# EAGLE design UselessBox (EAGLE 9.6.2)
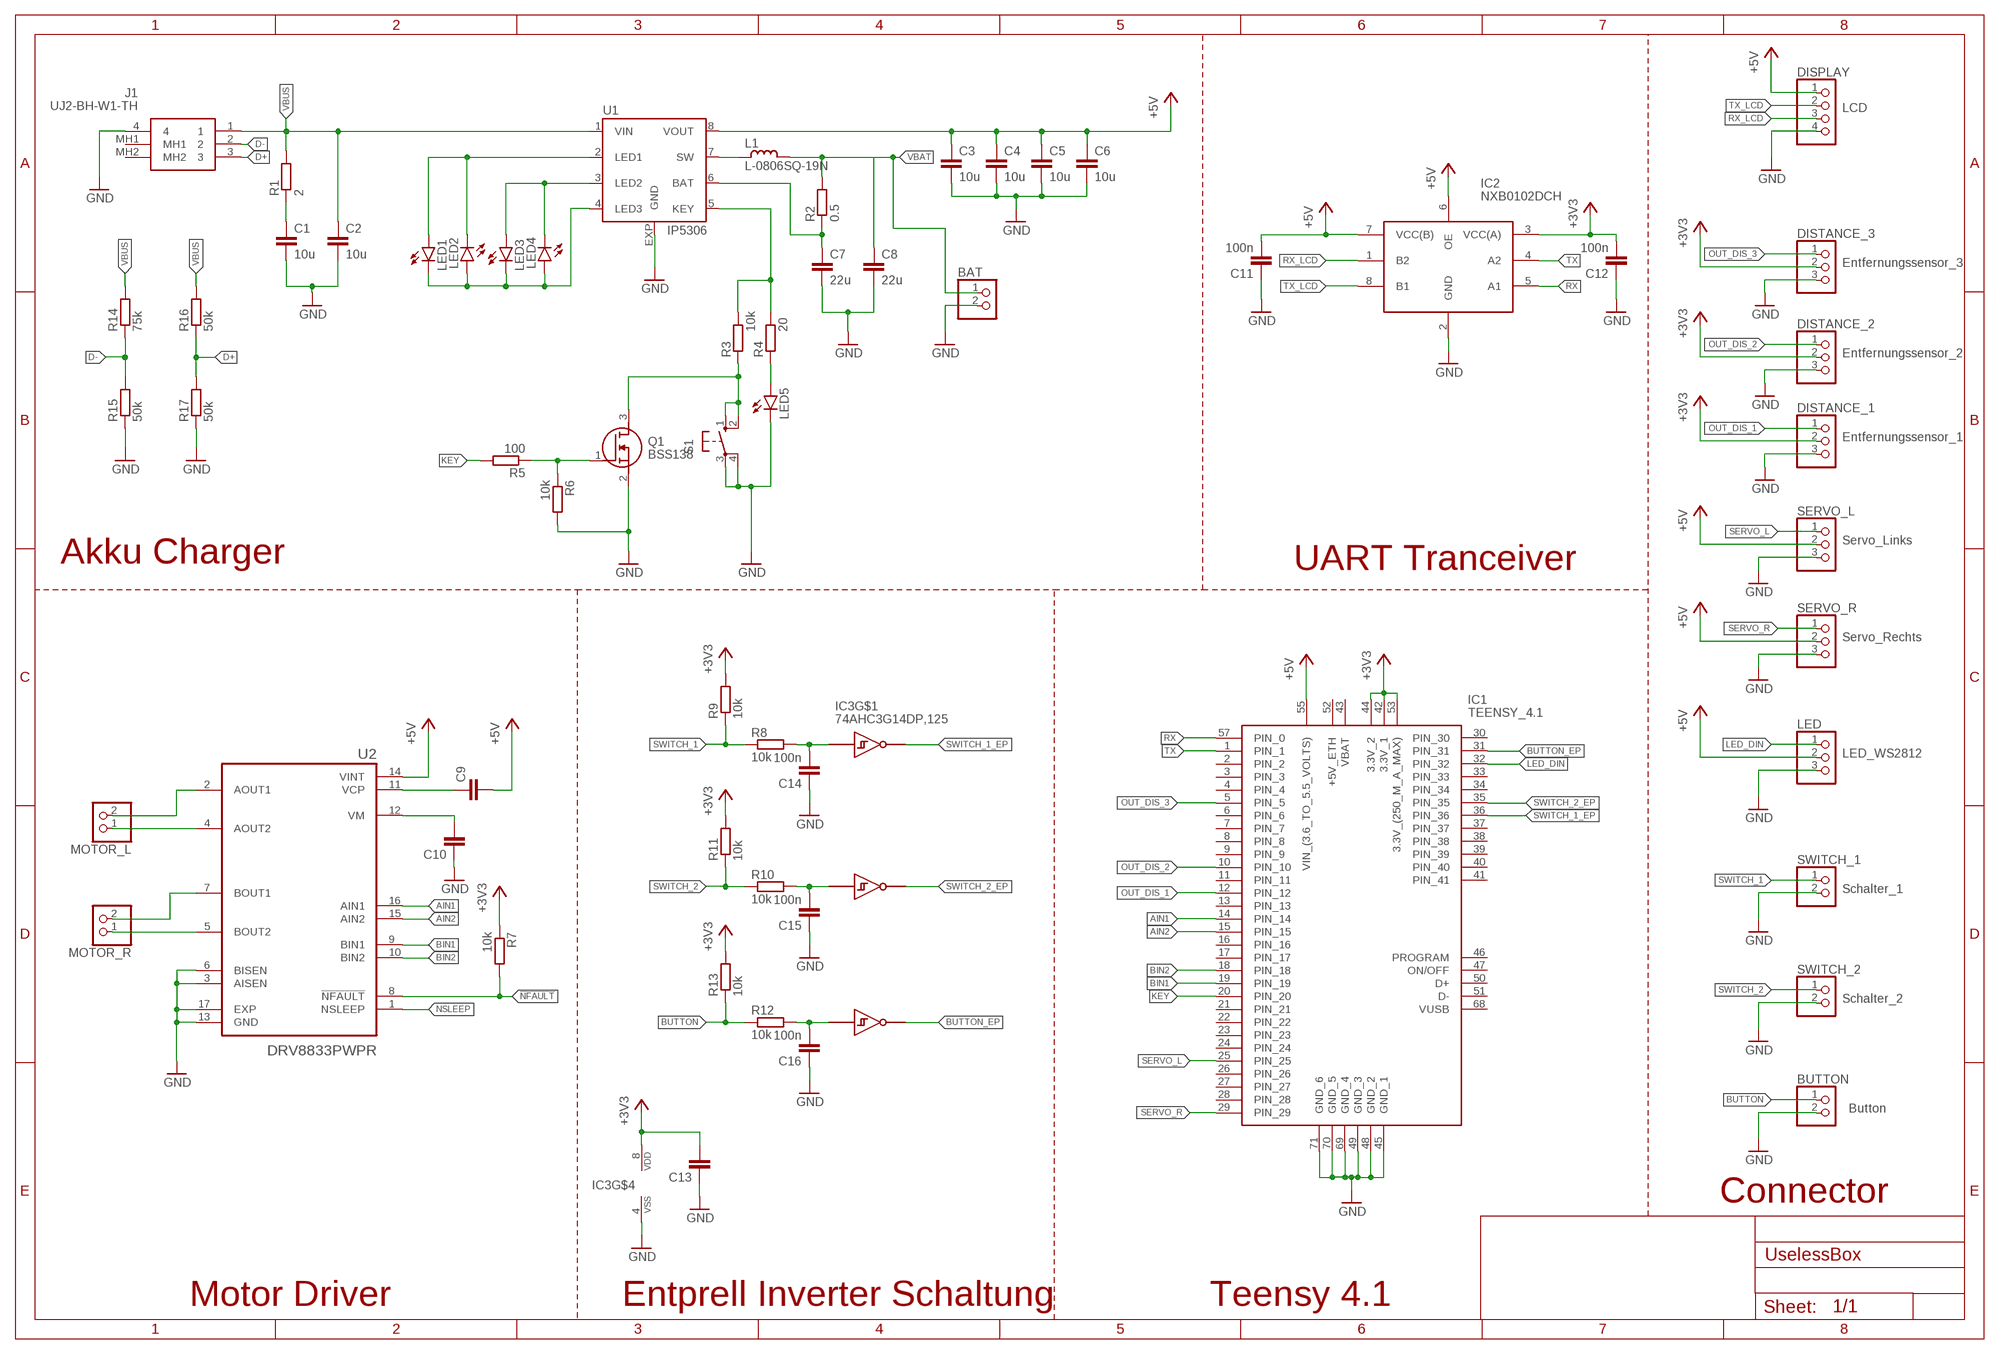
[diagram p0: schematic, sheet 1]

## Parts
BAT  PINHD-1X2  [1X02]
BUTTON  PINHD-1X2  [1X02]
C1  10u  C-EUC1206  [C1206]
C2  10u  C-EUC1206  [C1206]
C3  10u  C-EUC1206  [C1206]
C4  10u  C-EUC1206  [C1206]
C5  10u  C-EUC1206  [C1206]
C6  10u  C-EUC1206  [C1206]
C7  22u  C-EUC1206  [C1206]
C8  22u  C-EUC1206  [C1206]
C9  C-EUC0805  [C0805]
C10  C-EUC0805  [C0805]
C11  100n  C-EUC0805  [C0805]
C12  100n  C-EUC0805  [C0805]
C13  C-EUC0805  [C0805]
C14  100n  C-EUC0805  [C0805]
C15  100n  C-EUC0805  [C0805]
C16  100n  C-EUC0805  [C0805]
DISPLAY  PINHD-1X4  [1X04]
DISTANCE_1  PINHD-1X3  [1X03]
DISTANCE_2  PINHD-1X3  [1X03]
DISTANCE_3  PINHD-1X3  [1X03]
IC1  TEENSY_4.1  [TEENSY41]
IC2  NXB0102DCH  [SOP50P310X100-8N]
IC3  74AHC3G14DP,125  [SOP65P400X110-8N]
J1  UJ2-BH-W1-TH  [UJ2BHW1TH]
L1  L-0806SQ-19N  [0806SQ-19N]
LED  PINHD-1X3  [1X03]
LED1  LEDCHIPLED_0805  [CHIPLED_0805]
LED2  LEDCHIPLED_0805  [CHIPLED_0805]
LED3  LEDCHIPLED_0805  [CHIPLED_0805]
LED4  LEDCHIPLED_0805  [CHIPLED_0805]
LED5  LEDCHIPLED_0805  [CHIPLED_0805]
MOTOR_L  PINHD-1X2  [1X02]
MOTOR_R  PINHD-1X2  [1X02]
Q1  BSS138  [SOT95P240X120-3N]
R1  2  R-EU_R0805  [R0805]
R2  0.5  R-EU_R0805  [R0805]
R3  10k  R-EU_R0805  [R0805]
R4  20  R-EU_R0805  [R0805]
R5  100  R-EU_R0805  [R0805]
R6  10k  R-EU_R0805  [R0805]
R7  10k  R-EU_R0805  [R0805]
R8  10k  R-EU_R0805  [R0805]
R9  10k  R-EU_R0805  [R0805]
R10  10k  R-EU_R0805  [R0805]
R11  10k  R-EU_R0805  [R0805]
R12  10k  R-EU_R0805  [R0805]
R13  10k  R-EU_R0805  [R0805]
R14  75k  R-EU_R0805  [R0805]
R15  50k  R-EU_R0805  [R0805]
R16  50k  R-EU_R0805  [R0805]
R17  50k  R-EU_R0805  [R0805]
S1  10-XX  [B3F-10XX]
SERVO_L  PINHD-1X3  [1X03]
SERVO_R  PINHD-1X3  [1X03]
SWITCH_1  PINHD-1X2  [1X02]
SWITCH_2  PINHD-1X2  [1X02]
U1  IP5306  [SOP8-P]
U2  DRV8833PWPR  [IC_DRV8833PWPR]

## Nets
!NFAULT: R7.2 U2.8(!NFAULT)
+3V3: C12.2 C13.2 DISTANCE_1.2 DISTANCE_2.2 DISTANCE_3.2 IC1.42(3.3V_1) IC1.44(3.3V_2) IC1.53(3.3V_(250_M_A_MAX)) IC2.3(VCC(A)) IC3.8(VDD) R7.1 R9.2 R11.2 R13.2
+5V: C3.1 C4.1 C5.1 C6.1 C9.2 C11.2 DISPLAY.1 IC1.55(VIN_(3.6_TO_5.5_VOLTS)) IC2.6(OE) IC2.7(VCC(B)) LED.2 SERVO_L.2 SERVO_R.2 U1.8(VOUT) U2.14(VINT)
AIN1: IC1.14(PIN_14) U2.16(AIN1)
AIN2: IC1.15(PIN_15) U2.15(AIN2)
BIN1: IC1.19(PIN_19) U2.9(BIN1)
BIN2: IC1.18(PIN_18) U2.10(BIN2)
BUTTON: BUTTON.1 R12.1 R13.1
BUTTON_EP: IC1.31(PIN_31) IC3.2(Y)
D+: J1.3 R16.1 R17.2
D-: J1.2 R14.1 R15.2
GND: BAT.2 BUTTON.2 C1.2 C2.2 C3.2 C4.2 C5.2 C6.2 C7.2 C8.2 C10.1 C11.1 C12.1 C13.1 C14.1 C15.1 C16.1 DISPLAY.4 DISTANCE_1.3 DISTANCE_2.3 DISTANCE_3.3 IC1.45(GND_1) IC1.48(GND_2) IC1.49(GND_3) IC1.69(GND_4) IC1.70(GND_5) IC1.71(GND_6) IC2.2(GND) IC3.4(VSS) J1.4 LED5.C LED.3 Q1.2(S) R6.2 R15.1 R17.1 S1.3(P) S1.4(P1) SERVO_L.3 SERVO_R.3 SWITCH_1.2 SWITCH_2.2 U1.EXP(GND) U2.3(AISEN) U2.6(BISEN) U2.13(GND) U2.17(EXP)
KEY: IC1.20(PIN_20) R5.2
LED_DIN: IC1.32(PIN_32) LED.1
N$2: LED1.A LED2.C U1.2(LED1)
N$3: LED3.A LED4.C U1.3(LED2)
N$4: LED1.C LED2.A LED3.C LED4.A U1.4(LED3)
N$5: C1.1 R1.1
N$6: LED5.A R4.1
N$7: C7.1 R2.1 U1.6(BAT)
N$8: R3.2 R4.2 U1.5(KEY)
N$9: Q1.1(G) R5.1 R6.1
N$10: Q1.3(D) R3.1 S1.1(S) S1.2(S1)
N$11: L1.1 U1.7(SW)
N$12: MOTOR_L.1 U2.4(AOUT2)
N$13: MOTOR_L.2 U2.2(AOUT1)
N$14: MOTOR_R.1 U2.5(BOUT2)
N$15: MOTOR_R.2 U2.7(BOUT1)
N$16: C9.1 U2.11(VCP)
N$17: C10.2 U2.12(VM)
N$18: C15.2 IC3.3(A) R10.2
N$19: C14.2 IC3.1(A) R8.2
N$20: C16.2 IC3.6(A) R12.2
NSLEEP: U2.1(NSLEEP)
OUT_DIS_1: DISTANCE_1.1 IC1.12(PIN_12)
OUT_DIS_2: DISTANCE_2.1 IC1.10(PIN_10)
OUT_DIS_3: DISTANCE_3.1 IC1.5(PIN_5)
RX: IC1.57(PIN_0) IC2.5(A1)
RX_LCD: DISPLAY.3 IC2.1(B2)
SERVO_L: IC1.25(PIN_25) SERVO_L.1
SERVO_R: IC1.29(PIN_29) SERVO_R.1
SWITCH_1: R8.1 R9.1 SWITCH_1.1
SWITCH_1_EP: IC1.36(PIN_36) IC3.7(Y)
SWITCH_2: R10.1 R11.1 SWITCH_2.1
SWITCH_2_EP: IC1.35(PIN_35) IC3.5(Y)
TX: IC1.1(PIN_1) IC2.4(A2)
TX_LCD: DISPLAY.2 IC2.8(B1)
VBAT: BAT.1 C8.1 L1.2 R2.2
VBUS: C2.1 J1.1 R1.2 R14.2 R16.2 U1.1(VIN)
Unconnected: IC1.2(PIN_2) IC1.3(PIN_3) IC1.4(PIN_4) IC1.6(PIN_6) IC1.7(PIN_7) IC1.8(PIN_8) IC1.9(PIN_9) IC1.11(PIN_11) IC1.13(PIN_13) IC1.16(PIN_16) IC1.17(PIN_17) IC1.21(PIN_21) IC1.22(PIN_22) IC1.23(PIN_23) IC1.24(PIN_24) IC1.26(PIN_26) IC1.27(PIN_27) IC1.28(PIN_28) IC1.30(PIN_30) IC1.33(PIN_33) IC1.34(PIN_34) IC1.37(PIN_37) IC1.38(PIN_38) IC1.39(PIN_39) IC1.40(PIN_40) IC1.41(PIN_41) IC1.43(VBAT) IC1.46(PROGRAM) IC1.47(ON/OFF) IC1.50(D+) IC1.51(D-) IC1.52(+5V_ETH) IC1.68(VUSB) J1.MH1 J1.MH2

## Notes on the sheet
- LCD
- Entfernungssensor_3
- Entfernungssensor_2
- Entfernungssensor_1
- Servo_Links
- Akku Charger | UART Tranceiver
- Servo_Rechts
- LED_WS2812
- Schalter_1
- Schalter_2
- Button
- Connector
- Motor Driver | Entprell Inverter Schaltung | Teensy 4.1

## Library data of the parts
BAT BUTTON MOTOR_L MOTOR_R SWITCH_1 SWITCH_2 = pinhead:PINHD-1X2: PIN HEADER
C1-C16 = rcl:C-EU: CAPACITOR, European symbol; SPICEPREFIX: C
DISPLAY = pinhead:PINHD-1X4: PIN HEADER
DISTANCE_1-DISTANCE_3 LED SERVO_L SERVO_R = pinhead:PINHD-1X3: PIN HEADER
IC1 = TEENSY_4.1:TEENSY_4.1: Teensy 4.1 Development Board Source: Datasheet <https://www.pjrc.com/store/teensy41.html>; DESCRIPTION: Teensy 4.1 Development Board; HEIGHT: mm; MANUFACTURER_NAME: PJRC; MANUFACTURER_PART_NUMBER: TEENSY 4.1
IC2 = NXB0102DCH:NXB0102DCH: Voltage Level Translator 1-CH Unidirectional 8-Pin VSSOP T/R Source: Datasheet <https://assets.nexperia.com/documents/data-sheet/NXB0102.pdf>; DESCRIPTION: Voltage Level Translator 1-CH Unidirectional 8-Pin VSSOP T/R; HEIGHT: 1mm; MANUFACTURER_NAME: Nexperia; MANUFACTURER_PART_NUMBER: NXB0102DCH; MOUSER_PART_NUMBER: 771-NXB0102DCH; MOUSER_PRICE-STOCK: https://www.mouser.co.uk/ProductDetail/Nexperia/NXB0102DCH?qs=zW32dvEIR3t3BWStSBR6cA%3D%3D
IC3 = 74AHC3G14DP_125:74AHC3G14DP,125: 74AHC(T)3G14 - Triple inverting Schmitt trigger@en-us Source: Datasheet <https://assets.nexperia.com/documents/data-sheet/74AHC_AHCT3G14.pdf>; DESCRIPTION: 74AHC(T)3G14 - Triple inverting Schmitt trigger@en-us; HEIGHT: 1.1mm; MANUFACTURER_NAME: Nexperia; MANUFACTURER_PART_NUMBER: 74AHC3G14DP,125; MOUSER_PART_NUMBER: 771-AHC3G14DP125; MOUSER_PRICE-STOCK: https://www.mouser.co.uk/ProductDetail/Nexperia/74AHC3G14DP125?qs=P62ublwmbi8pkJ4kOimCvQ%3D%3D
J1 = UJ2-BH-W1-TH:UJ2-BH-W1-TH: USB Connectors USB 2.0 type B jack 4 pin Horiz White TH Source: Datasheet <https://www.cuidevices.com/product/resource/uj2-bh-th.pdf>; ARROW_PART_NUMBER: UJ2-BH-W1-TH; ARROW_PRICE-STOCK: https://www.arrow.com/en/products/uj2-bh-w1-th/cui-devices?region=nac; DESCRIPTION: USB Connectors USB 2.0 type B jack 4 pin Horiz White TH; HEIGHT: 11.48mm; MANUFACTURER_NAME: CUI Inc.; MANUFACTURER_PART_NUMBER: UJ2-BH-W1-TH; MOUSER_PART_NUMBER: 490-UJ2-BH-W1-TH; MOUSER_PRICE-STOCK: https://www.mouser.co.uk/ProductDetail/CUI-Devices/UJ2-BH-W1-TH?qs=5mqXD9RfOg3dpHLjDScu%2Fg%3D%3D
L1 = inductor-coilcraft2:L-: SMD INDUCTOR
LED1-LED5 = led:LED: LED OSRAM: - CHIPLED LG R971, LG N971, LY N971, LG Q971, LY Q971, LO R971, LY R971 LH N974, LH R974 LS Q976, LO Q976, LY Q976 LO Q996 - Hyper CHIPLED LW Q18S LB Q993, LB Q99A, LB R99A - SideLED LS A670, LO A670, LY A670, LG A670, LP A670 LB A673, LV A673, LT A673, LW A673 LH A674 LY A675 LS A676, LA A676, LO A676, LY A676, LW A676 LS A679, LY A679, LG A679 - Hyper Micro SIDELED® LS Y876, LA Y876, LO Y876, LY Y876 LT Y87S - SmartLED LW L88C, LW L88S LB L89C, LB L89S, LG L890 LS L89K, LO L89K, LY L89K LS L896, LA L896, LO L896, LY L896 - TOPLED LS T670, LO T670, LY T670, LG T670, LP T670 LSG T670, LSP T670, LSY T670, LOP T670, LYG T670 LG T671, LOG T671, LSG T671 LB T673, LV T673, LT T673, LW T673 LH T674 LS T676, LA T676, LO T676, LY T676, LB T676, LH T676, LSB T676, LW T676 LB T67C, LV T67C, LT T67C, LS T67K, LO T67K, LY T67K, LW E67C LS E67B, LA E67B, LO E67B, LY E67B, LB E67C, LV E67C, LT E67C LW T67C LS T679, LY T679, LG T679 LS T770, LO T770, LY T770, LG T770, LP T770 LB T773, LV T773, LT T773, LW T773 LH T774 LS E675, LA E675, LY E675, LS T675 LS T776, LA T776, LO T776, LY T776, LB T776 LHGB T686 LT T68C, LB T68C - Hyper Mini TOPLED® LB M676 - Mini TOPLED Santana® LG M470 LS M47K, LO M47K, LY M47K Source: http://www.osram.convergy.de LUXEON: - LUMILED® LXK2-PW12-R00, LXK2-PW12-S00, LXK2-PW14-U00, LXK2-PW14-V00 LXK2-PM12-R00, LXK2-PM12-S00, LXK2-PM14-U00 LXK2-PE12-Q00, LXK2-PE12-R00, LXK2-PE12-S00, LXK2-PE14-T00, LXK2-PE14-U00 LXK2-PB12-K00, LXK2-PB12-L00, LXK2-PB12-M00, LXK2-PB14-N00, LXK2-PB14-P00, LXK2-PB14-Q00 LXK2-PR12-L00, LXK2-PR12-M00, LXK2-PR14-Q00, LXK2-PR14-R00 LXK2-PD12-Q00, LXK2-PD12-R00, LXK2-PD12-S00 LXK2-PH12-R00, LXK2-PH12-S00 LXK2-PL12-P00, LXK2-PL12-Q00, LXK2-PL12-R00 Source: www.luxeon.com KINGBRIGHT: KA-3528ASYC Source: www.kingbright.com
Q1 = BSS138:BSS138: N-channel MOSFET,BSS138 0.2A 50V Source: Datasheet <https://www.onsemi.com/pub/Collateral/BSS138-D.PDF>; ARROW_PART_NUMBER: BSS138; ARROW_PRICE-STOCK: https://www.arrow.com/en/products/bss138/on-semiconductor; DESCRIPTION: N-channel MOSFET,BSS138 0.2A 50V; HEIGHT: 1.2mm; MANUFACTURER_NAME: onsemi; MANUFACTURER_PART_NUMBER: BSS138; MOUSER_PART_NUMBER: 512-BSS138; MOUSER_PRICE-STOCK: https://www.mouser.co.uk/ProductDetail/ON-Semiconductor-Fairchild/BSS138?qs=HK%252BeIG1iaahCeqBvjB4arg%3D%3D
R1-R17 = rcl:R-EU_: RESISTOR, European symbol; SPICEPREFIX: R
S1 = switch-omron:10-XX: OMRON SWITCH; MPN: B3F-1000; OC_FARNELL: 176432; OC_NEWARK: 36M3542
U1 = IP5306:IP5306: Check availability <https://pricing.snapeda.com/parts/IP5306/NXP%20USA%20Inc./view-part?ref=eda>; AVAILABILITY: In Stock; DESCRIPTION: RC (Pi) EMI Filter 2nd Order Low Pass 2 Channel R = 2.2kOhms, C = 1700pF 8-UFBGA, WLCSP; MF: NXP USA Inc.; MP: IP5306; PACKAGE: UFBGA-8 NXP Semiconductors; PRICE: None; PURCHASE-URL: https://pricing.snapeda.com/search/part/IP5306/?ref=eda
U2 = DRV8833PWPR:DRV8833PWPR: 10.8-V, 2-A dual H-bridge motor driver with current regulation 16-HTSSOP -40 to 85 Check availability <https://pricing.snapeda.com/parts/DRV8833PWPR/Texas%20Instruments/view-part?ref=eda>; AVAILABILITY: In Stock; DESCRIPTION: 10.8-V, 2-A dual H-bridge motor driver with current regulation; MF: Texas Instruments; MP: DRV8833PWPR; PACKAGE: HTSSOP-16 Texas Instruments; PRICE: None; PURCHASE-URL: https://pricing.snapeda.com/search/part/DRV8833PWPR/?ref=eda

## Board
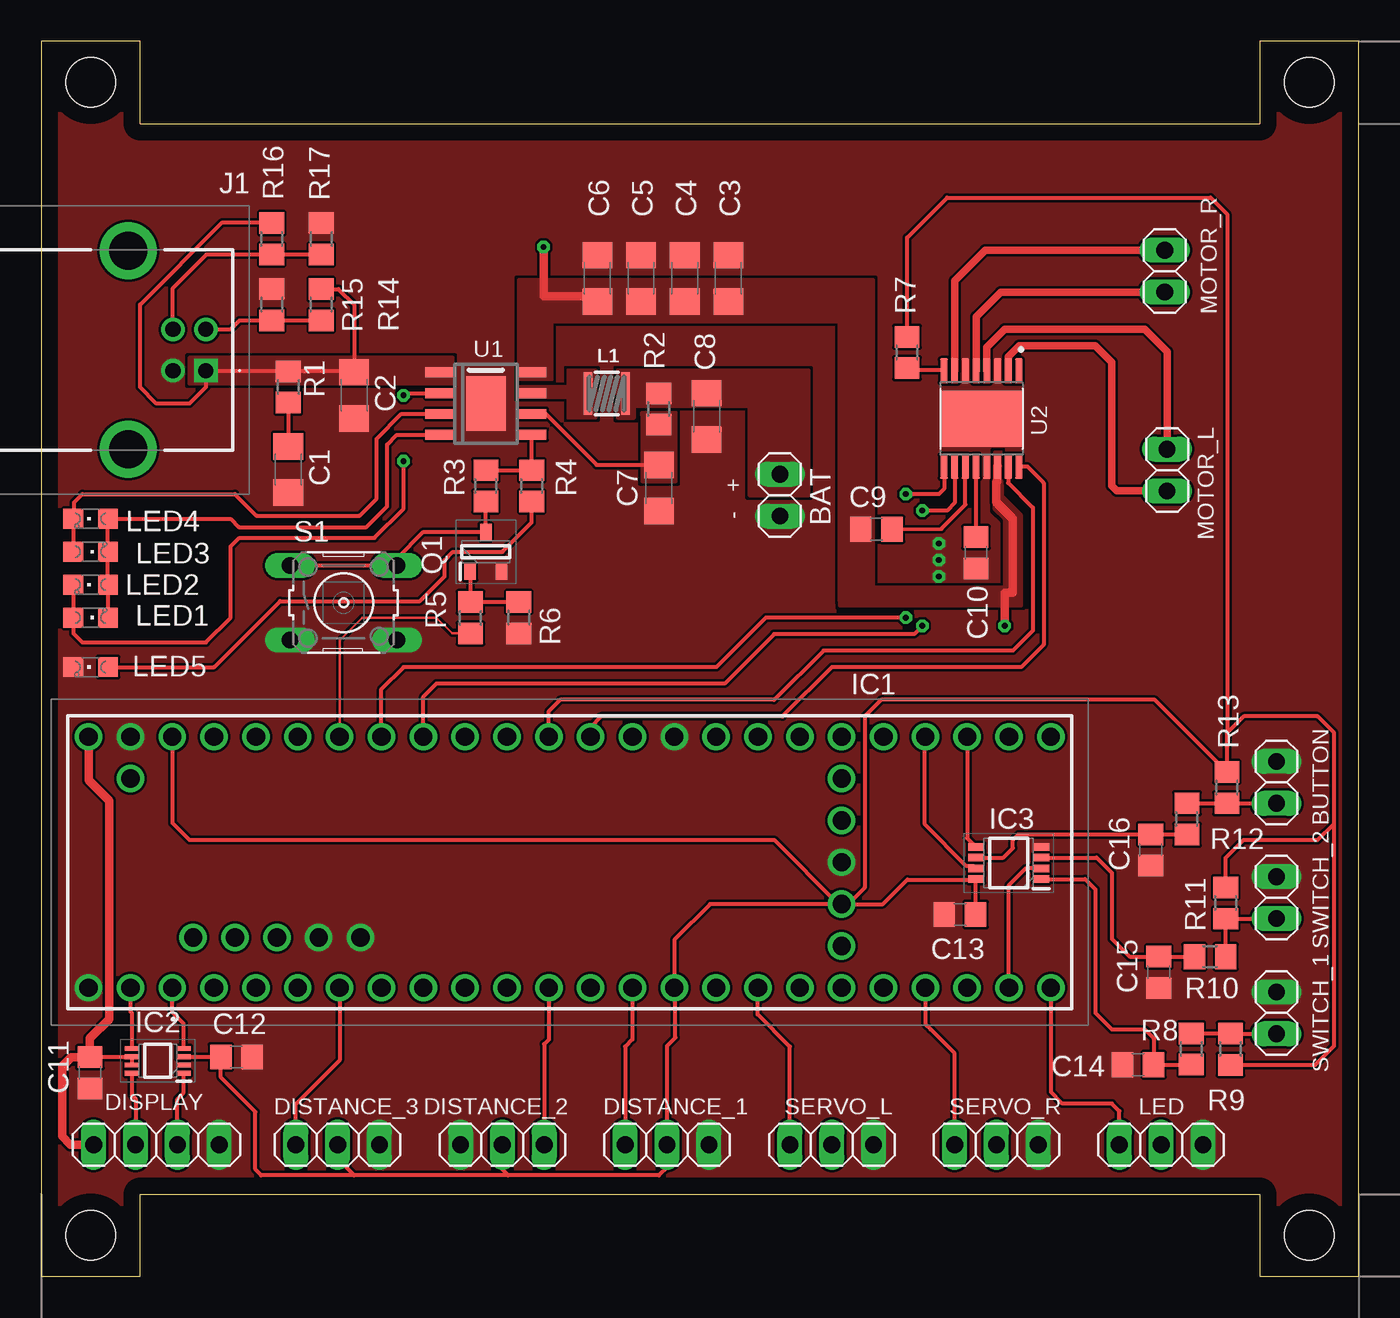
[diagram p1: board, top side]
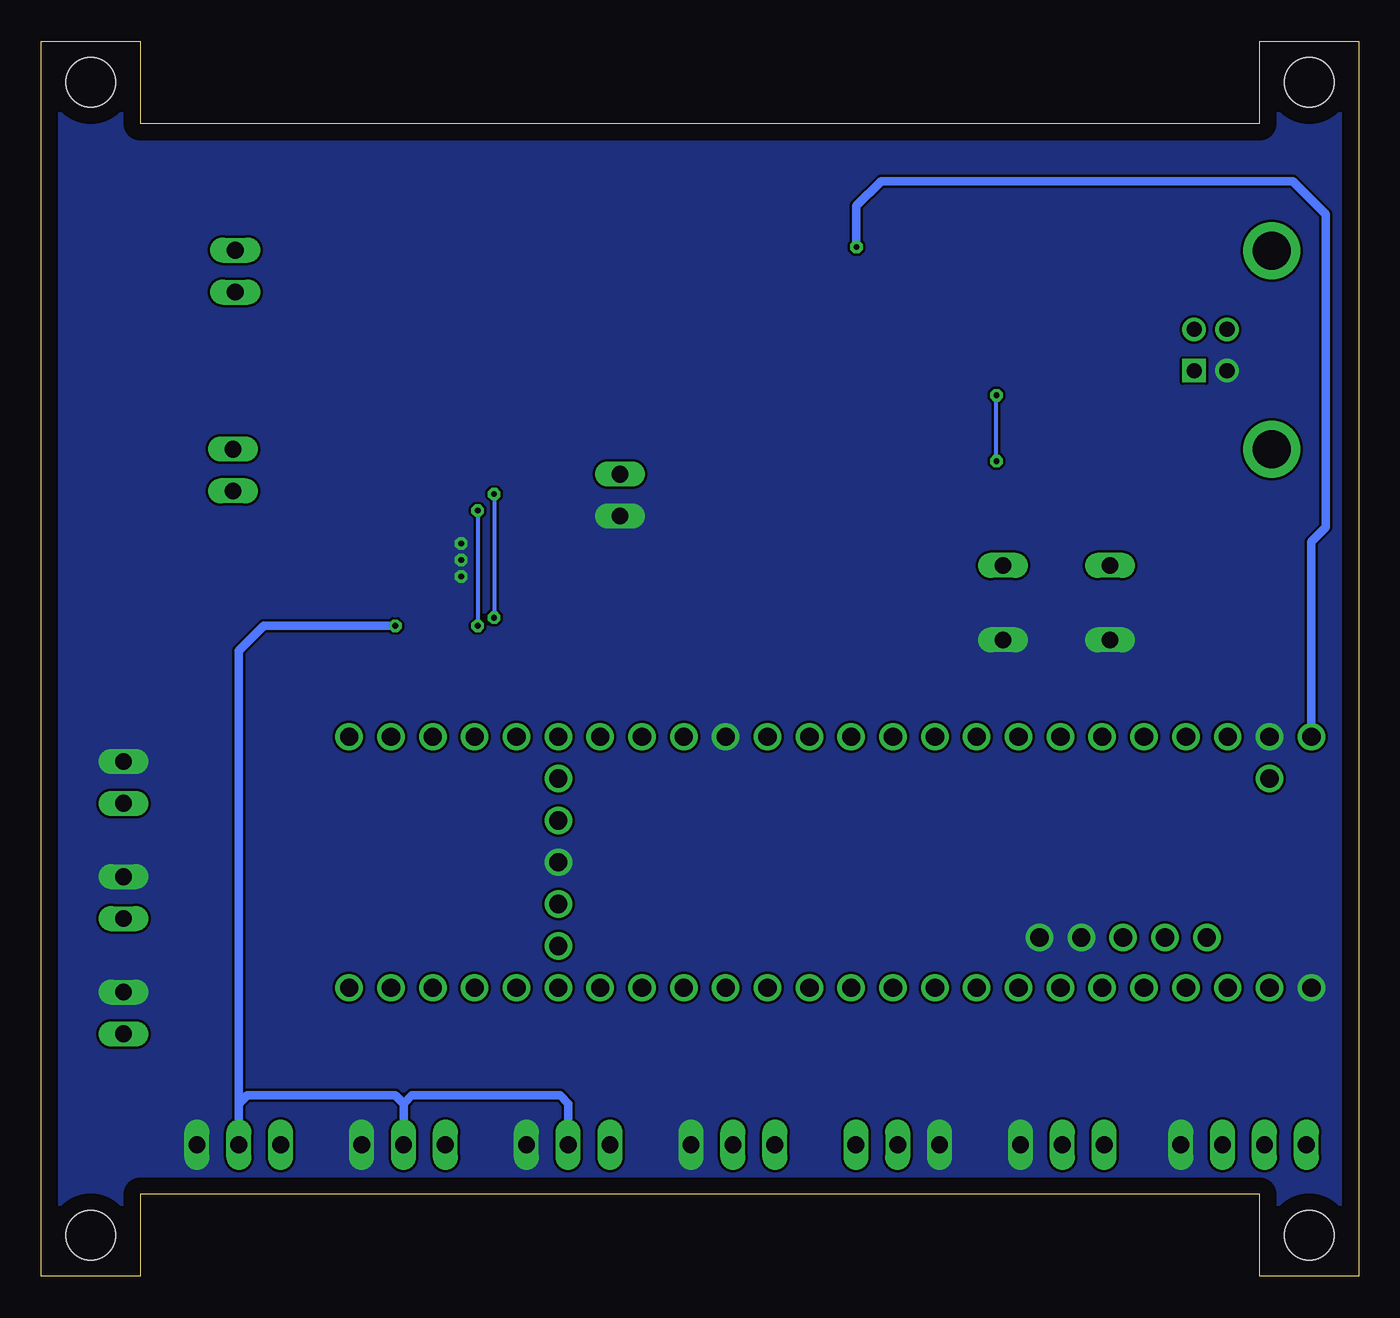
[diagram p2: board, bottom side, seen from below]

Size 80 x 75 mm. Coordinates in mm from the lower left corner, seen from the top.
Outline: 80,0 80,75 74,75 74,70 6,70 6,75 0,75 0,0 6,0 6,5 74,5 74,0 80,0
Copper layers (1*16): Top 0.035mm / dielectric 1.5mm / Bottom 0.035mm
Design rules "default": minimum track width 6mil, minimum drill 0.35mm, track to track 6mil, track to pad 6mil, pad to pad 6mil, via to via 6mil, smd to smd 6mil, copper to edge 40mil, drill to drill 6mil, minimum pad ring 10mil, minimum via ring 8mil, stop-mask expansion 4mil, vias tented up to drill 0mil, thermal gap 10mil
Holes 3 mm at 3,2.5 77,2.5 3,72.5 77,72.5

### Footprints (pad centres in the part's own frame; a part is rotated, then mirrored left to right if it is on the bottom)
1X02 = drill 1.016 long: 1 -1.27,0; 2 1.27,0
C1206 = smd 1.6 x 1.8: 1 -1.4,0; 2 1.4,0
C0805 = smd 1.3 x 1.5: 1 -0.95,0; 2 0.95,0
1X04 = drill 1.016 long: 1 -3.81,0; 2 -1.27,0; 3 1.27,0; 4 3.81,0
1X03 = drill 1.016 long: 1 -2.54,0; 2 0,0; 3 2.54,0
TEENSY41 = drill 1.11 pad 1.665: 1 0,0; 2 2.54,0; 3 5.08,0; 4 7.62,0; 5 10.16,0; 6 12.7,0; 7 15.24,0; 8 17.78,0; 9 20.32,0; 10 22.86,0; 11 25.4,0; 12 27.94,0; 13 27.94,15.24; 14 25.4,15.24; 15 22.86,15.24; 16 20.32,15.24; 17 17.78,15.24; 18 15.24,15.24; 19 12.7,15.24; 20 10.16,15.24; 21 7.62,15.24; 22 5.08,15.24; 23 2.54,15.24; 24 33.02,0; 25 35.56,0; 26 38.1,0; 27 40.64,0; 28 43.18,0; 29 45.72,0; 30 48.26,0; 31 50.8,0; 32 53.34,0; 33 53.34,15.24; 34 50.8,15.24; 35 48.26,15.24; 36 45.72,15.24; 37 43.18,15.24; 38 40.64,15.24; 39 38.1,15.24; 40 35.56,15.24; 41 33.02,15.24; 42 30.48,0; 43 40.64,2.54; 44 40.64,5.08; 45 40.64,7.62; 46 40.64,10.16; 47 40.64,12.7; 48 11.43,3.05; 49 8.89,3.05; 50 6.35,3.05; 51 3.81,3.05; 52 1.27,3.05; 53 0,15.24; 55 -5.08,15.24; 57 -2.54,0; 68 -2.54,12.7; 69 30.48,15.24; 70 -2.54,15.24; 71 -5.08,0
SOP50P310X100-8N = smd 0.85 x 0.3: 1 -1.575,0.75; 2 -1.575,0.25; 3 -1.575,-0.25; 4 -1.575,-0.75; 5 1.575,-0.75; 6 1.575,-0.25; 7 1.575,0.25; 8 1.575,0.75
SOP65P400X110-8N = smd 0.95 x 0.45: 1 -1.975,0.975; 2 -1.975,0.325; 3 -1.975,-0.325; 4 -1.975,-0.975; 5 1.975,-0.975; 6 1.975,-0.325; 7 1.975,0.325; 8 1.975,0.975
UJ2BHW1TH = drill 0.92 pad 1.431 square: 1 0,0 | drill 0.92 pad 1.431: 2 -2.5,0; 3 -2.5,-2; 4 0,-2 | drill 2.3 pad 3.45: MH1 -7.27,-4.71; MH2 4.77,-4.71
0806SQ-19N = smd 0.51 x 2.6: 1 -1.145,0; 2 1.145,0
CHIPLED_0805 = smd 1.2 x 1.2: A 0,-1.05; C 0,1.05
SOT95P240X120-3N = smd 1 x 0.7: 1 -1.2,0.95; 2 -1.2,-0.95; 3 1.2,0
R0805 = smd 1.3 x 1.5: 1 -0.95,0; 2 0.95,0
B3F-10XX = drill 1.016 long: 1 -3.251,2.261; 2 3.251,2.261; 3 -3.251,-2.261; 4 3.251,-2.261
SOP8-P = smd 0.6 x 1.75: 1 -1.905,-2.8; 2 -0.635,-2.8; 3 0.635,-2.8; 4 1.905,-2.8; 5 1.905,2.8; 6 0.635,2.8; 7 -0.635,2.8; 8 -1.905,2.8 | smd 3.3 x 2.41: EXP 0,0
IC_DRV8833PWPR = smd 1.5 x 0.45: 1 -2.9,2.275; 2 -2.9,1.625; 3 -2.9,0.975; 4 -2.9,0.325; 5 -2.9,-0.325; 6 -2.9,-0.975; 7 -2.9,-1.625; 8 -2.9,-2.275; 9 2.9,-2.275; 10 2.9,-1.625; 11 2.9,-0.975; 12 2.9,-0.325; 13 2.9,0.325; 14 2.9,0.975; 15 2.9,1.625; 16 2.9,2.275 | smd 3.4 x 5: 17 0,0

### Placement (x,y rotation side)
BAT  44.85,47.44 270 top
BUTTON  75,30 90 top
C1  15,49 270 top
C2  19,53.5 270 top
C3  41.72,60.6 90 top
C4  39.07,60.6 90 top
C5  36.42,60.6 90 top
C6  33.77,60.6 90 top
C7  37.5,47.87 270 top
C8  40.4,52.22 270 top
C9  50.71,45.37 180 top
C10  56.76,43.94 90 top
C11  2.96,12.37 90 top
C12  11.86,13.33 180 top
C13  55.78,21.98 0 top
C14  66.59,12.86 0 top
C15  67.85,18.47 90 top
C16  67.37,25.89 90 top
DISPLAY  7,8 0 top
DISTANCE_1  38,8 0 top
DISTANCE_2  28,8 180 top
DISTANCE_3  18,8 0 top
IC1  7.96,17.53 0 top
IC2  7.08,13.09 180 top
IC3  58.74,25.1 180 top
J1  10,55 270 top
L1  34.34,53.61 0 top
LED  68,8 0 top
LED1  3,40 270 top
LED2  3,42 90 top
LED3  3,44 270 top
LED4  3,46 90 top
LED5  3,37 90 top
MOTOR_L  68.36,48.96 270 top
MOTOR_R  68.22,61.04 90 top
Q1  27,44 90 top
R1  15,54 90 top
R2  37.5,52.67 90 top
R3  27,48 90 top
R4  29.78,48 90 top
R5  26.06,39.99 270 top
R6  29,40 270 top
R7  52.57,56.1 270 top
R8  69.82,13.81 270 top
R9  72.21,13.8 270 top
R10  70.97,19.41 180 top
R11  71.92,22.67 90 top
R12  69.56,27.78 270 top
R13  71.99,29.68 90 top
R14  17,59 90 top
R15  14,59 270 top
R16  14,63 90 top
R17  17,63 270 top
S1  18.36,40.91 0 top
SERVO_L  48,8 0 top
SERVO_R  58,8 0 top
SWITCH_1  75,16 90 top
SWITCH_2  75,23 90 top
U1  27,53 270 top
U2  57.09,52.08 270 top

### Tracks (layer width: path | path; a pad name or v marks a point on that pad's centre or on a via)
!NFAULT
  Top 0.254: U2.8 54.76,55.03 52.81,55.03 52.69,55.15 R7.2
+3V3
  Top 0.254: IC2.3 C12.2 10.91,12.09 13,10 13,6.5 13.36,6.14 19,6.14 | C13.2 56.73,24.09 | 56.73,24.09 IC3.8 | IC1.44 49,22.61 | 49,22.61 51.11,22.61 52.59,24.09 56.73,24.09 | 28.36,6.14 28,6.5 DISTANCE_2.2 | 28.36,6.14 37.5,6.14 38,6.64 DISTANCE_1.2 38,14 38.5,14.5 38.5,17.47 IC1.42 38.44,20.44 40.61,22.61 IC1.44 | 28.36,6.14 19,6.14 | 19,6.14 18,7.14 DISTANCE_3.2 | R11.2 71.92,25.42 73,26.5 77.5,26.5 78.5,27.5 | 71.99,32.5 71.99,32.99 73,34 77.5,34 78.5,33 78.5,27.5 | 71.99,32.5 R13.2 67.62,35 51,35 50,34 50,23.61 49,22.61 | R9.2 77.35,12.85 78.5,14 78.5,27.5 | R7.1 52.57,63.07 55,65.5 71,65.5 72,64.5 72,32.51 71.99,32.5 | IC1.53 7.96,27.54 9,26.5 44.5,26.5 48.39,22.61 IC1.44
+5V  (via drill 0.35)
  Top 0.254: C11.2 2.98,13.34 IC2.6 IC2.7
  Top 0.508: DISPLAY.1 1.77,8 1.27,8.5 1.27,12.77 1.82,13.32 C11.2 2.96,14.46 4.12,15.62 4.12,28.88 2.88,30.12 IC1.55 | v30.5,62.5 30.5,59.5 33.47,59.5 C6.1 | v58.5,39.5 58.5,41.5 59,41.5 59,46 58,47 58,48.25 58.05,48.3 58.05,49.16 U2.14
  Bottom 0.508: SERVO_L.2 48,10.5 48.5,11 57.5,11 58,10.5 | SERVO_R.2 58,10.5 | 58,10.5 58.5,11 67.5,11 68,10.5 | 68,10.5 LED.2 | IC1.55 2.88,44.62 2,45.5 2,64.5 4,66.5 29,66.5 30.5,65 v30.5,62.5 | 68,10.5 68,38 66.5,39.5 v58.5,39.5
  pour Top (no thermals): 29,60.5 29,54.5 31,54.5 31,58 50.5,58 50.5,60.5
  pour Top (no thermals): 50.5,60.5 50.5,41 48.5,41 48.5,60.5
  pour Top (no thermals): 48.5,40.75 59.5,40.75 59.5,46.21 58.34,47.37 58.34,50 57.88,50 57.88,46.62 58.5,46 58.5,41.82 48.5,41.82
AIN1
  Top 0.254: U2.16 59.87,49.18 60.87,48.18 60.87,38.37 59.5,37 48,37 45,34 34,34 33.36,33.36 IC1.14
AIN2
  Top 0.254: U2.15 58.72,48.18 60.22,46.68 60.22,39.22 59,38 47.5,38 44.5,35 31.5,35 30.82,34.32 IC1.15
BIN1  (via drill 0.35)
  Top 0.254: v52.5,40 44,40 41,37 22,37 20.66,35.66 IC1.19 | U2.9 54.81,47.81 54.5,47.5 v52.5,47.5
  Bottom 0.254: v52.5,47.5 v52.5,40
BIN2  (via drill 0.35)
  Top 0.254: v53.5,39.5 53,39 44.5,39 41.5,36 24,36 23.2,35.2 IC1.18 | U2.10 55.47,46.97 55,46.5 v53.5,46.5
  Bottom 0.254: v53.5,46.5 v53.5,39.5
BUTTON
  Top 0.254: R12.1 R13.1 BUTTON.1
BUTTON_EP
  Top 0.254: IC3.2 59.77,24.77 58.86,23.86 58.76,23.76 IC1.31
D+
  Top 0.254: J1.3 8,60 10.05,62.05 R16.1 R17.2
D-
  Top 0.254: J1.2 11.5,57.5 12.05,58.05 R15.2 R14.1
GND  (via drill 0.35)
  other vias: 54.5,44.5 54.5,43.5 54.5,42.5
  pour Top (rank 2, no thermals): 54.5,56 54.5,48 60,48 60,56
  pour Top (rank 2, no thermals): -3.5,73.5 87,73.5 87,15 87,-1.5 -5,-1.5 -5,73.5
  pour Bottom (rank 2, no thermals): -5,73.5 87,73.5 87,-1.5 -5,-1.5
KEY
  Top 0.152: R5.2 24.96,39.04 24,40 19.5,40 18.12,38.62 IC1.20
LED_DIN
  Top 0.254: LED.1 65.46,10.04 65,10.5 62,10.5 61.3,11.2 IC1.32
N$2  (via drill 0.35)
  Top 0.254: LED2.C LED1.A 1.95,39.05 2.5,38.5 10,38.5 11.5,40 11.5,44.32 12.03,44.85 20.23,44.85 22,46.62 v22,49.5 | v22,53.5 22.14,53.63 U1.2
  Bottom 0.254: v22,49.5 v22,53.5
N$3
  Top 0.254: LED3.A LED4.C 2,46.05 2,47 2.5,47.5 11.76,47.5 13.07,46.19 19.33,46.19 20.36,47.22 20.36,50.86 21.86,52.37 U1.3
N$4
  Top 0.254: LED1.C LED2.A LED3.C LED4.A 11.5,46 12,45.5 19.74,45.5 21,46.76 21,50.5 21.59,51.09 U1.4
N$5
  Top 0.254: R1.1 C1.1
N$6
  Top 0.254: LED5.A 10.5,37 14.5,41 23,41 24.5,42.5 24.5,43.5 25,44 28,44 29.78,45.78 R4.1
N$7
  Top 0.254: U1.6 30.64,52.37 33.73,49.27 C7.1
  pour Top (no thermals): 36.49,52.38 36.49,48.29 38.53,48.29 38.54,48.29 38.54,52.41 36.48,52.41 36.48,52.3
N$8
  Top 0.254: R3.2 R4.2 29.78,51.09 U1.5
N$9
  Top 0.254: Q1.1 R5.1 R6.1
N$10
  Top 0.254: R3.1 Q1.3 23.2,45.2 21.61,43.61 S1.2 S1.1
N$11
  pour Top (no thermals): 28.99,53.4 32,53.4 32,52.16 33.67,52.16 33.67,55 32,55 32,54 29,54 29,53.41
N$12
  Top 0.457: U2.4 57.41,56.41 58.5,57.5 67,57.5 68.36,56.14 MOTOR_L.1
N$13
  Top 0.457: MOTOR_L.2 65.31,47.69 65,48 65,55.5 64,56.5 59.37,56.5 58.72,55.85 U2.2
N$14
  Top 0.457: U2.5 56.77,58.27 58.27,59.77 68,59.77
  Top 0.508: 68,59.77 MOTOR_R.1
N$15
  Top 0.457: U2.7 55.47,60.47 57.31,62.31 MOTOR_R.2
N$16
  Top 0.254: C9.1 54.65,45.39 56.12,46.85 U2.11
N$17
  Top 0.254: C10.2 U2.12
N$18
  Top 0.254: R10.2 C15.2 66.08,19.42 65,20.5 65,24.5 64.08,25.43 IC3.3
N$19
  Top 0.254: R8.2 C14.2 67.54,14.46 67,15 65,15 64,16 64,23.5 63.38,24.12 IC3.1
N$20
  Top 0.254: R12.2 C16.2 59.34,26.84 59,26.5 59,26 58.42,25.43 IC3.6
OUT_DIS_1
  Top 0.254: IC1.12 35.9,14.4 35.46,13.96 DISTANCE_1.1
OUT_DIS_2
  Top 0.254: IC1.10 30.82,14.38 30.54,14.1 DISTANCE_2.1
OUT_DIS_3
  Top 0.254: DISTANCE_3.1 15.46,10.46 18.12,13.12 IC1.5
RX
  Top 0.254: IC2.5 5.5,16 5.42,16.08 IC1.57
RX_LCD
  Top 0.254: DISPLAY.3 8.27,10.77 8.65,11.16 IC2.1
SERVO_L
  Top 0.254: SERVO_L.1 45.46,13.96 43.5,15.92 43.5,17.51 IC1.25
SERVO_R
  Top 0.254: SERVO_R.1 55.46,13.54 54,15 53.68,15.32 IC1.29
SWITCH_1
  Top 0.254: R8.1 R9.1 74.98,14.75 SWITCH_1.1
SWITCH_1_EP
  Top 0.254: IC3.7 56.62,24.92 56.17,24.92 53.65,27.45 53.65,32.74 IC1.36
SWITCH_2
  Top 0.254: R10.1 R11.1 SWITCH_2.1
SWITCH_2_EP
  Top 0.254: IC3.5 56.42,26.42 56.22,26.62 IC1.35
TX
  Top 0.254: IC2.4 8.65,15.35 7.96,16.04 IC1.1
TX_LCD
  Top 0.254: IC2.8 5.5,11.02 5.73,10.79 DISPLAY.2
VBAT
  pour Top (no thermals): 35,55 35,52.15 36,52.15 36,52.86 46.57,52.86 46.57,55
  pour Top (no thermals): 43,55 43,47.44 44.28,47.44 46.59,47.44 46.59,54.99 46.59,55
VBUS
  Top 0.254: R14.2 18.05,59.95 19,59 C2.1 18.95,54.95 16,54.95 | 16,54.95 R1.2 | 16,54.95 15.95,55 J1.1 10,54 9,53 7,53 6,54 6,59 11,64 13.95,64 R16.2
  pour Top (no thermals): 9,55.77 9,54.22 24.99,54.22 24.99,55.77

### Text on the board
tNames: - +